# Altium schematic sheet SD.SchDoc
size A; SheetNumber: 5; SheetTotal: 10
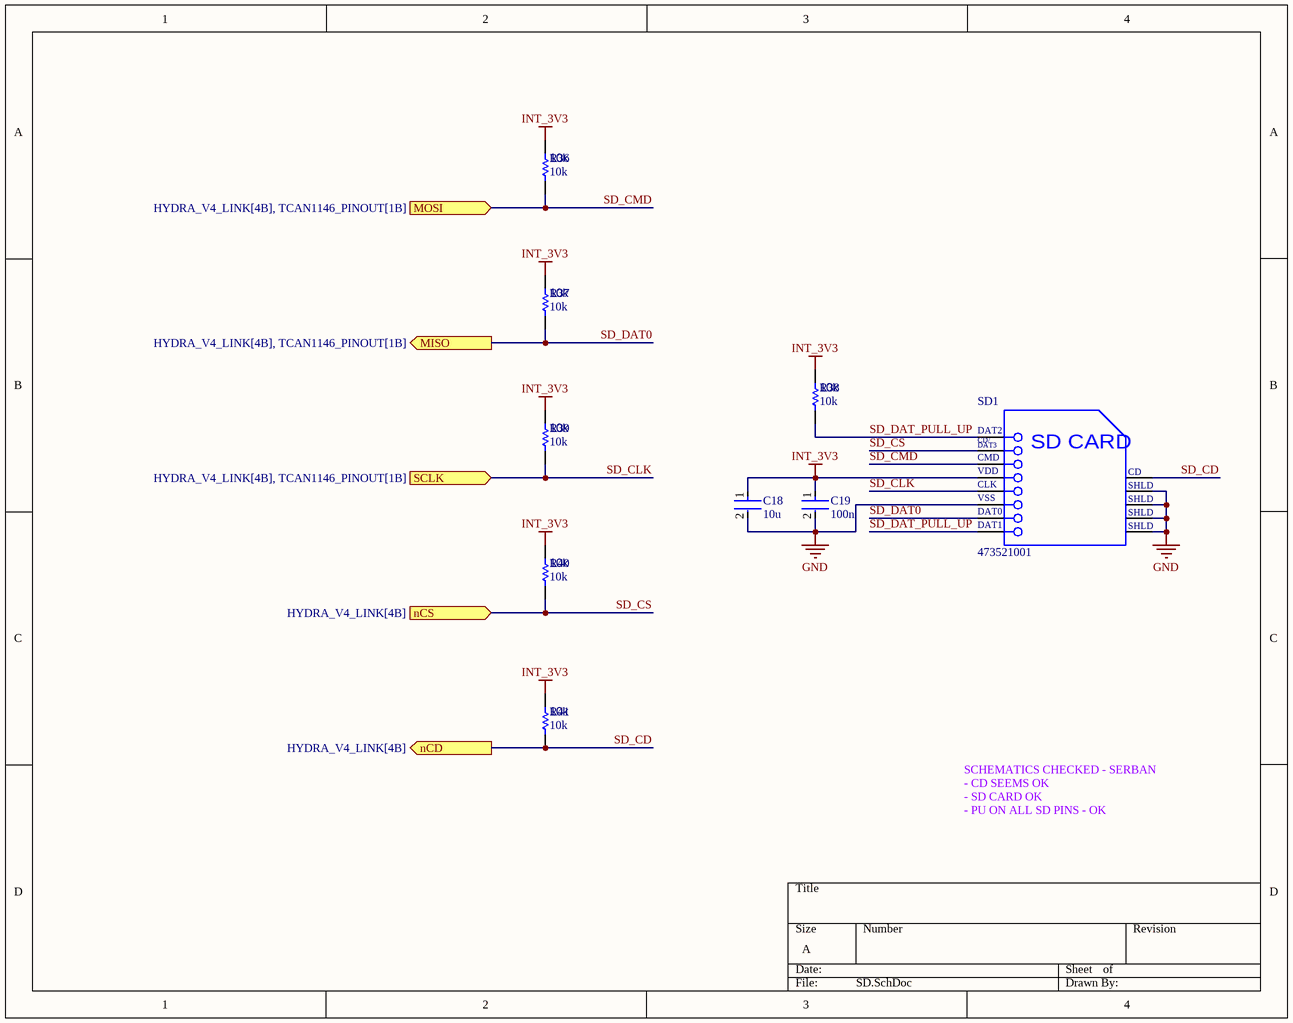
[diagram p0: SD.SchDoc]

## Parts
C18  10u  [FP-0402-L_1_0_0_05-W_0_5-IPC_A]
C19  100n  [FP-0402-L_1_0_0_05-W_0_5-IPC_A]
R36  10k  [R0603B]
R37  10k  [R0603B]
R38  10k  [R0603B]
R39  10k  [R0603B]
R40  10k  [R0603B]
R41  10k  [R0603B]
SD1  473521001  [MOLX-473521001_V]

## Ports
MISO (out, see HYDRA_V4_LINK[4B], TCAN1146_PINOUT[1B]), MOSI (in, see HYDRA_V4_LINK[4B], TCAN1146_PINOUT[1B]), nCD (out, see HYDRA_V4_LINK[4B]), nCS (in, see HYDRA_V4_LINK[4B]), SCLK (in, see HYDRA_V4_LINK[4B], TCAN1146_PINOUT[1B])

## Nets
GND: C18.2 C19.2 SD1.6(VSS) SD1.10(SHLD) SD1.11(SHLD) SD1.12(SHLD) SD1.13(SHLD)
INT_3V3: C18.1 C19.1 R36.1 R37.1 R38.1 R39.1 R40.1 R41.1 SD1.4(VDD)
SD_CD: R41.2 SD1.9(CD) ; port nCD
SD_CLK: R39.2 SD1.5(CLK) ; port SCLK
SD_CMD: R36.2 SD1.3(CMD) ; port MOSI
SD_CS: R40.2 SD1.2(CD/DAT3) ; port nCS
SD_DAT0: R37.2 SD1.7(DAT0) ; port MISO
SD_DAT_PULL_UP: R38.2 SD1.1(DAT2) SD1.8(DAT1)

## Notes on the sheet
- SCHEMATICS CHECKED - SERBAN
  - CD SEEMS OK
  - SD CARD OK
  - PU ON ALL SD PINS - OK
- (in symbol CMP-2000-05848-1) CD/; DAT3; SD CARD

## Library data of the parts
C18 C19 = CMP-001-00058-1: LARGE PADS, 0402 CAP, CHANGE COMMENT TO MATCH REAL P/N; Capacitor Type: Ceramic; Min Operating Temperature: -55°C; Mounting Technology: Surface Mount; Pins: 2; Case/Package: 0402; RoHS Compliant: Yes; Max Operating Temperature: 85°C
  C18: Value: 10u
  C19: Value: 100n
R36-R41 = CMP-009-00002-14: Resistor; Value: 10k
SD1 = CMP-2000-05848-1: MicroSD(TM), Pitch 1.1 mm, 8 Position, Height 1.88 mm, -20 to 85 degC, RoHS, Tape and Reel; Manufacturer: Molex; Datasheet Version: Rev. G, 01/2012; Datasheet URL: http://www.molex.com/pdm_docs/sd/473521001_sd.pdf; Package Reference: 473521001; Manufacturer URL: http://www.molex.com/; Mounting Technology: SurfaceMount; Package Description: MicroSD(TM), Pitch 1.1 mm, 8 Position, Height 1.88 mm